# EasyEDA schematic SCH_Flight-Computer-V3_2024-07-16.json
TITLE: Sheet_1; REV: 1.0; Date: 2024-07-16; Sheet: 1/1; Drawn By: usedgenes; Company: Your Company
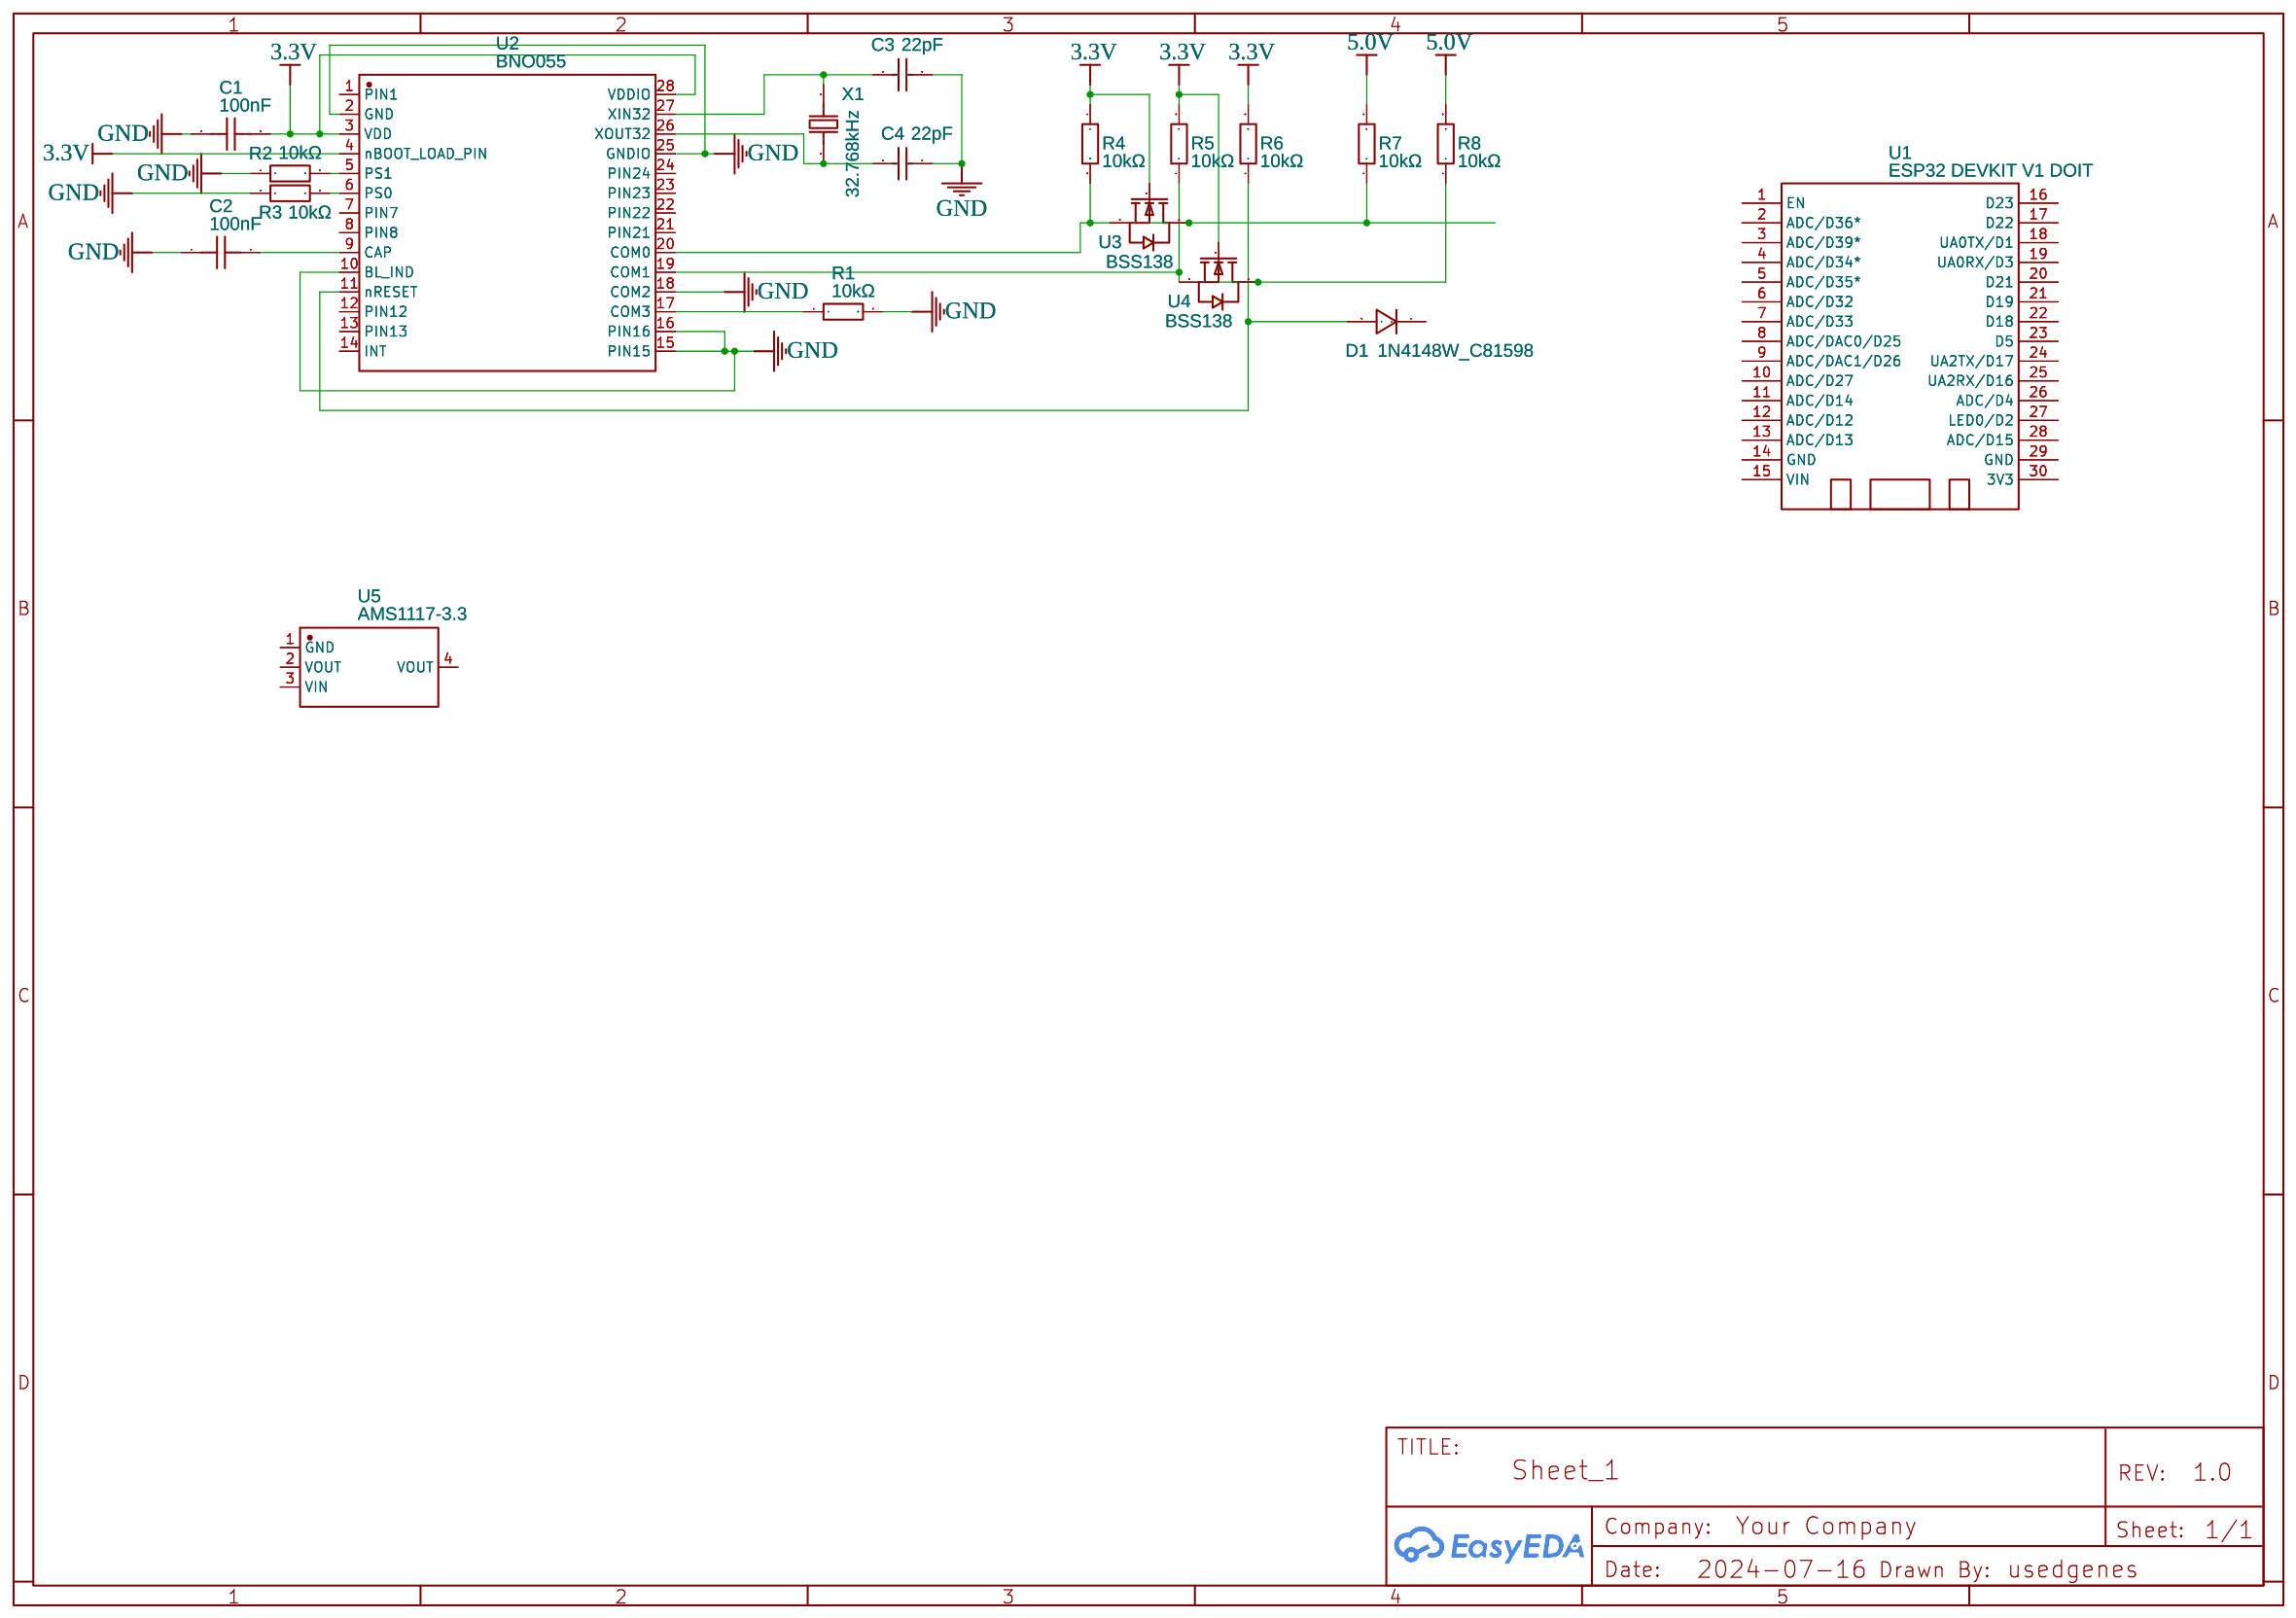
[diagram p0: schematic sheet]

## Parts
C1  100nF  [C0603]
C2  100nF  [C0603]
C3  22pF  [C0402]
C4  22pF  [C0402]
D1  1N4148W_C81598  [SOD-123F_L2.7-W1.6-LS3.8-RD]
R1  10kΩ  [R0402]
R2  10kΩ  [R0402]
R3  10kΩ  [R0402]
R4  10kΩ  [R0402]
R5  10kΩ  [R0402]
R6  10kΩ  [R0402]
R7  10kΩ  [R0402]
R8  10kΩ  [R0402]
U1  ESP32 DEVKIT V1 DOIT  [DOIT-ESP32-DEVKIT-V1]
U2  BNO055  [LGA-28_L5.2-W3.8-P0.50-BL]
U3  BSS138  [SOT-23-3_L2.9-W1.3-P1.90-LS2.4-BR]
U4  BSS138  [SOT-23-3_L2.9-W1.3-P1.90-LS2.4-BR]
U5  AMS1117-3.3  [SOT-223-3_L6.5-W3.4-P2.30-LS7.0-BR]
X1  32.768kHz  [OSC-SMD_L3.2-W1.5]

## Library data of the parts
C1 C2 = CC0603KRX7R9BB104: Supplier: LCSC; Manufacturer: YAGEO(国巨); Supplier Part: C14663; JLCPCB Part Class: Basic Part
C3 C4 = 0402CG220J500NT: Supplier: LCSC; Manufacturer: FH(风华); Supplier Part: C1555; JLCPCB Part Class: Basic Part
D1 = 1N4148W_C81598: Supplier: LCSC; Manufacturer: ST(先科); Manufacturer Part: 1N4148W; Supplier Part: C81598; JLCPCB Part Class: Basic Part
R1-R8 = 0402WGF1002TCE: Supplier: LCSC; Manufacturer: UNI-ROYAL(厚声); Supplier Part: C25744; JLCPCB Part Class: Basic Part
U1 = ESP32 DEVKIT V1 DOIT: Contributor: ConceitoTeam
U2 = BNO055: Contributor: LCSC; Supplier: LCSC; Supplier Part: C93216; Manufacturer: Bosch(博世); JLCPCB Part Class: Extended Part
U3 U4 = BSS138_C7420339: Contributor: lcsc; Supplier: LCSC; Supplier Part: C7420339; Manufacturer: 宏迦橙; JLCPCB Part Class: Extended Part
U5 = AMS1117-3.3: sourceId: dwIGgezVh; Supplier: LCSC; Manufacturer: AMS; Supplier Part: C6186; JLCPCB Part Class: Basic Part
X1 = SC-32S32.768kHz20PPM12.5pF: Supplier: LCSC; Manufacturer: Seiko(精工); Supplier Part: C97606; JLCPCB Part Class: Extended Part

## Nets
3.3V: C1.2 R4.1 R5.2 R6.2 U2.3(VDD) U2.4(nBOOT_LOAD_PIN) U2.28(VDDIO) U3.1(G) U4.1(G)
5.0V: R7.2 R8.2
GND: C1.1 C2.1 C3.2 C4.2 R1.2 R2.1 R3.1 U2.2(GND) U2.10(BL_IND) U2.15(PIN15) U2.16(PIN16) U2.18(COM2) U2.25(GNDIO)
Net-(C2-2): C2.2 U2.9(CAP)
Net-(C3-1): C3.1 U2.27(XIN32) X1.2
Net-(C4-1): C4.1 U2.26(XOUT32) X1.1
Net-(D1-2): D1.2(A) R6.1 U2.11(nRESET)
Net-(R1-1): R1.1 U2.17(COM3)
Net-(R2-2): R2.2 U2.5(PS1)
Net-(R3-2): R3.2 U2.6(PS0)
Net-(R4-2): R4.2 U2.20(COM0) U3.2(S)
Net-(R5-1): R5.1 U2.19(COM1) U4.2(S)
Net-(R7-1): R7.1 U3.3(D)
Net-(R8-1): R8.1 U4.3(D)

Not connected (* = marked no-connect by the designer): D1 1(K); U1 1(EN) 2(ADC/D36*) 3(ADC/D39*) 4(ADC/D34*) 5(ADC/D35*) 6(ADC/D32) 7(ADC/D33) 8(ADC/DAC0/D25) 9(ADC/DAC1/D26) 10(ADC/D27) 11(ADC/D14) 12(ADC/D12) 13(ADC/D13) 14(GND) 15(VIN) 16(D23) 17(D22) 18(UA0TX/D1) 19(UA0RX/D3) 20(D21) 21(D19) 22(D18) 23(D5) 24(UA2TX/D17) 25(UA2RX/D16) 26(ADC/D4) 27(LED0/D2) 28(ADC/D15) 29(GND) 30(3V3); U2 1(PIN1) 7(PIN7) 8(PIN8) 12(PIN12) 13(PIN13) 14(INT) 21(PIN21) 22(PIN22) 23(PIN23) 24(PIN24); U5 1(GND) 2(VOUT) 3(VIN) 4(VOUT)

## Notes on the sheet
- 20, 19, 14, 11
